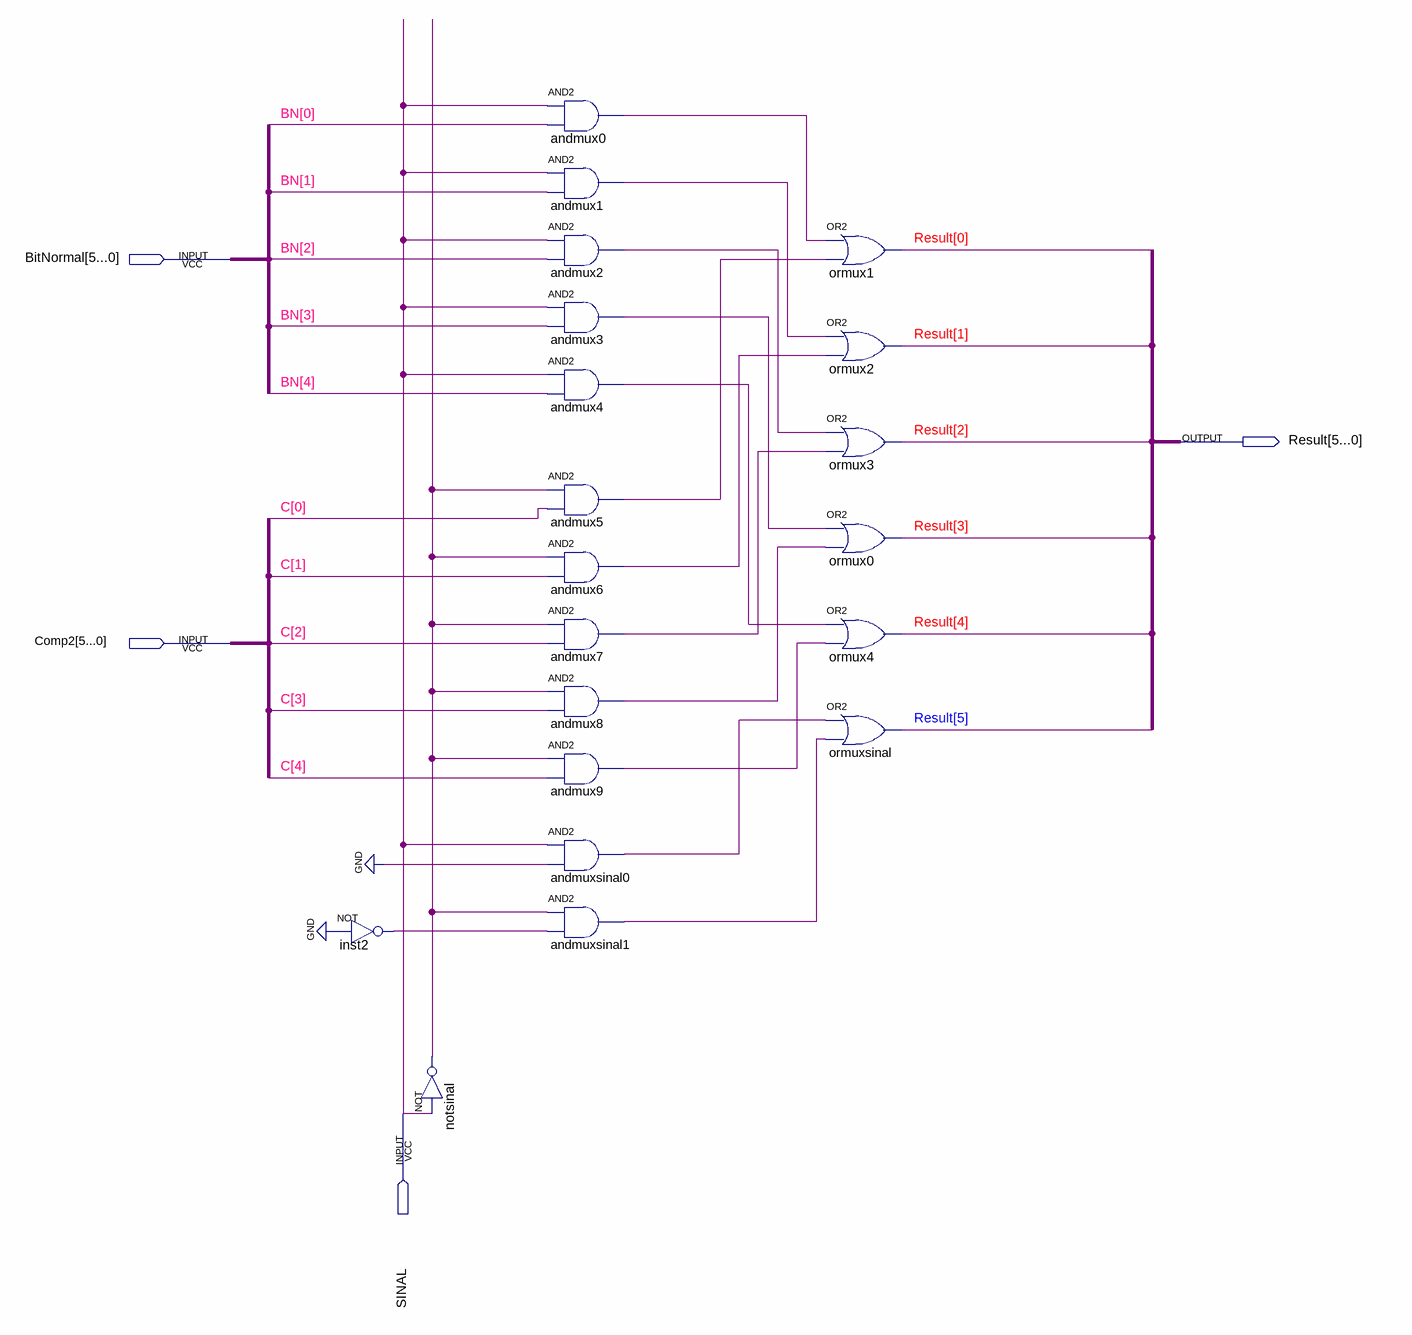
[diagram p0: schematic sheet]
// Quartus schematic MuxSomador.bdf as structural Verilog: 20 symbols, 4 pins
module MuxSomador (
  input  \BitNormal[5...0] ,
  input  \Comp2[5...0] ,
  input  SINAL,
  output \Result[5...0] 
);

  wire andmux0_out, andmux1_out, andmux2_out, andmux3_out, andmux4_out, andmux5_out, andmux6_out,
       andmux7_out, andmux8_out, andmux9_out, andmuxsinal0_out, andmuxsinal1_out, inst2_out, notsinal_out;
  wire [4:0] BN, C;
  wire [5:0] Result;

  not inst2 (inst2_out, 1'b0);
  not notsinal (notsinal_out, SINAL);
  and andmux0 (andmux0_out, SINAL, BN[0]);
  and andmux1 (andmux1_out, SINAL, BN[1]);
  and andmux2 (andmux2_out, SINAL, BN[2]);
  and andmux3 (andmux3_out, SINAL, BN[3]);
  and andmux4 (andmux4_out, SINAL, BN[4]);
  and andmux5 (andmux5_out, notsinal_out, C[0]);
  and andmux6 (andmux6_out, notsinal_out, C[1]);
  and andmux7 (andmux7_out, notsinal_out, C[2]);
  and andmux8 (andmux8_out, notsinal_out, C[3]);
  and andmux9 (andmux9_out, notsinal_out, C[4]);
  and andmuxsinal0 (andmuxsinal0_out, SINAL, 1'b0);
  and andmuxsinal1 (andmuxsinal1_out, notsinal_out, inst2_out);
  or ormux1 (Result[0], andmux0_out, andmux5_out);
  or ormux2 (Result[1], andmux1_out, andmux6_out);
  or ormux3 (Result[2], andmux2_out, andmux7_out);
  or ormux0 (Result[3], andmux3_out, andmux8_out);
  or ormux4 (Result[4], andmux4_out, andmux9_out);
  or ormuxsinal (Result[5], andmuxsinal0_out, andmuxsinal1_out);
endmodule
